# Altium schematic sheet Shutdown_2019_v1.1_BSPD.SchDoc: Shutdown_2019_v1.1
size 453 x 301 mm; Date: 1/4/2019 10:42:16 PM; SheetNumber: 3; GateName_1: G$1; SymbolName_1: FRAME_B_L; LibraryName: frames; DeviceSetName: FRAME_B_L; GateName_2: G$2; SymbolName_2: DOCFIELD
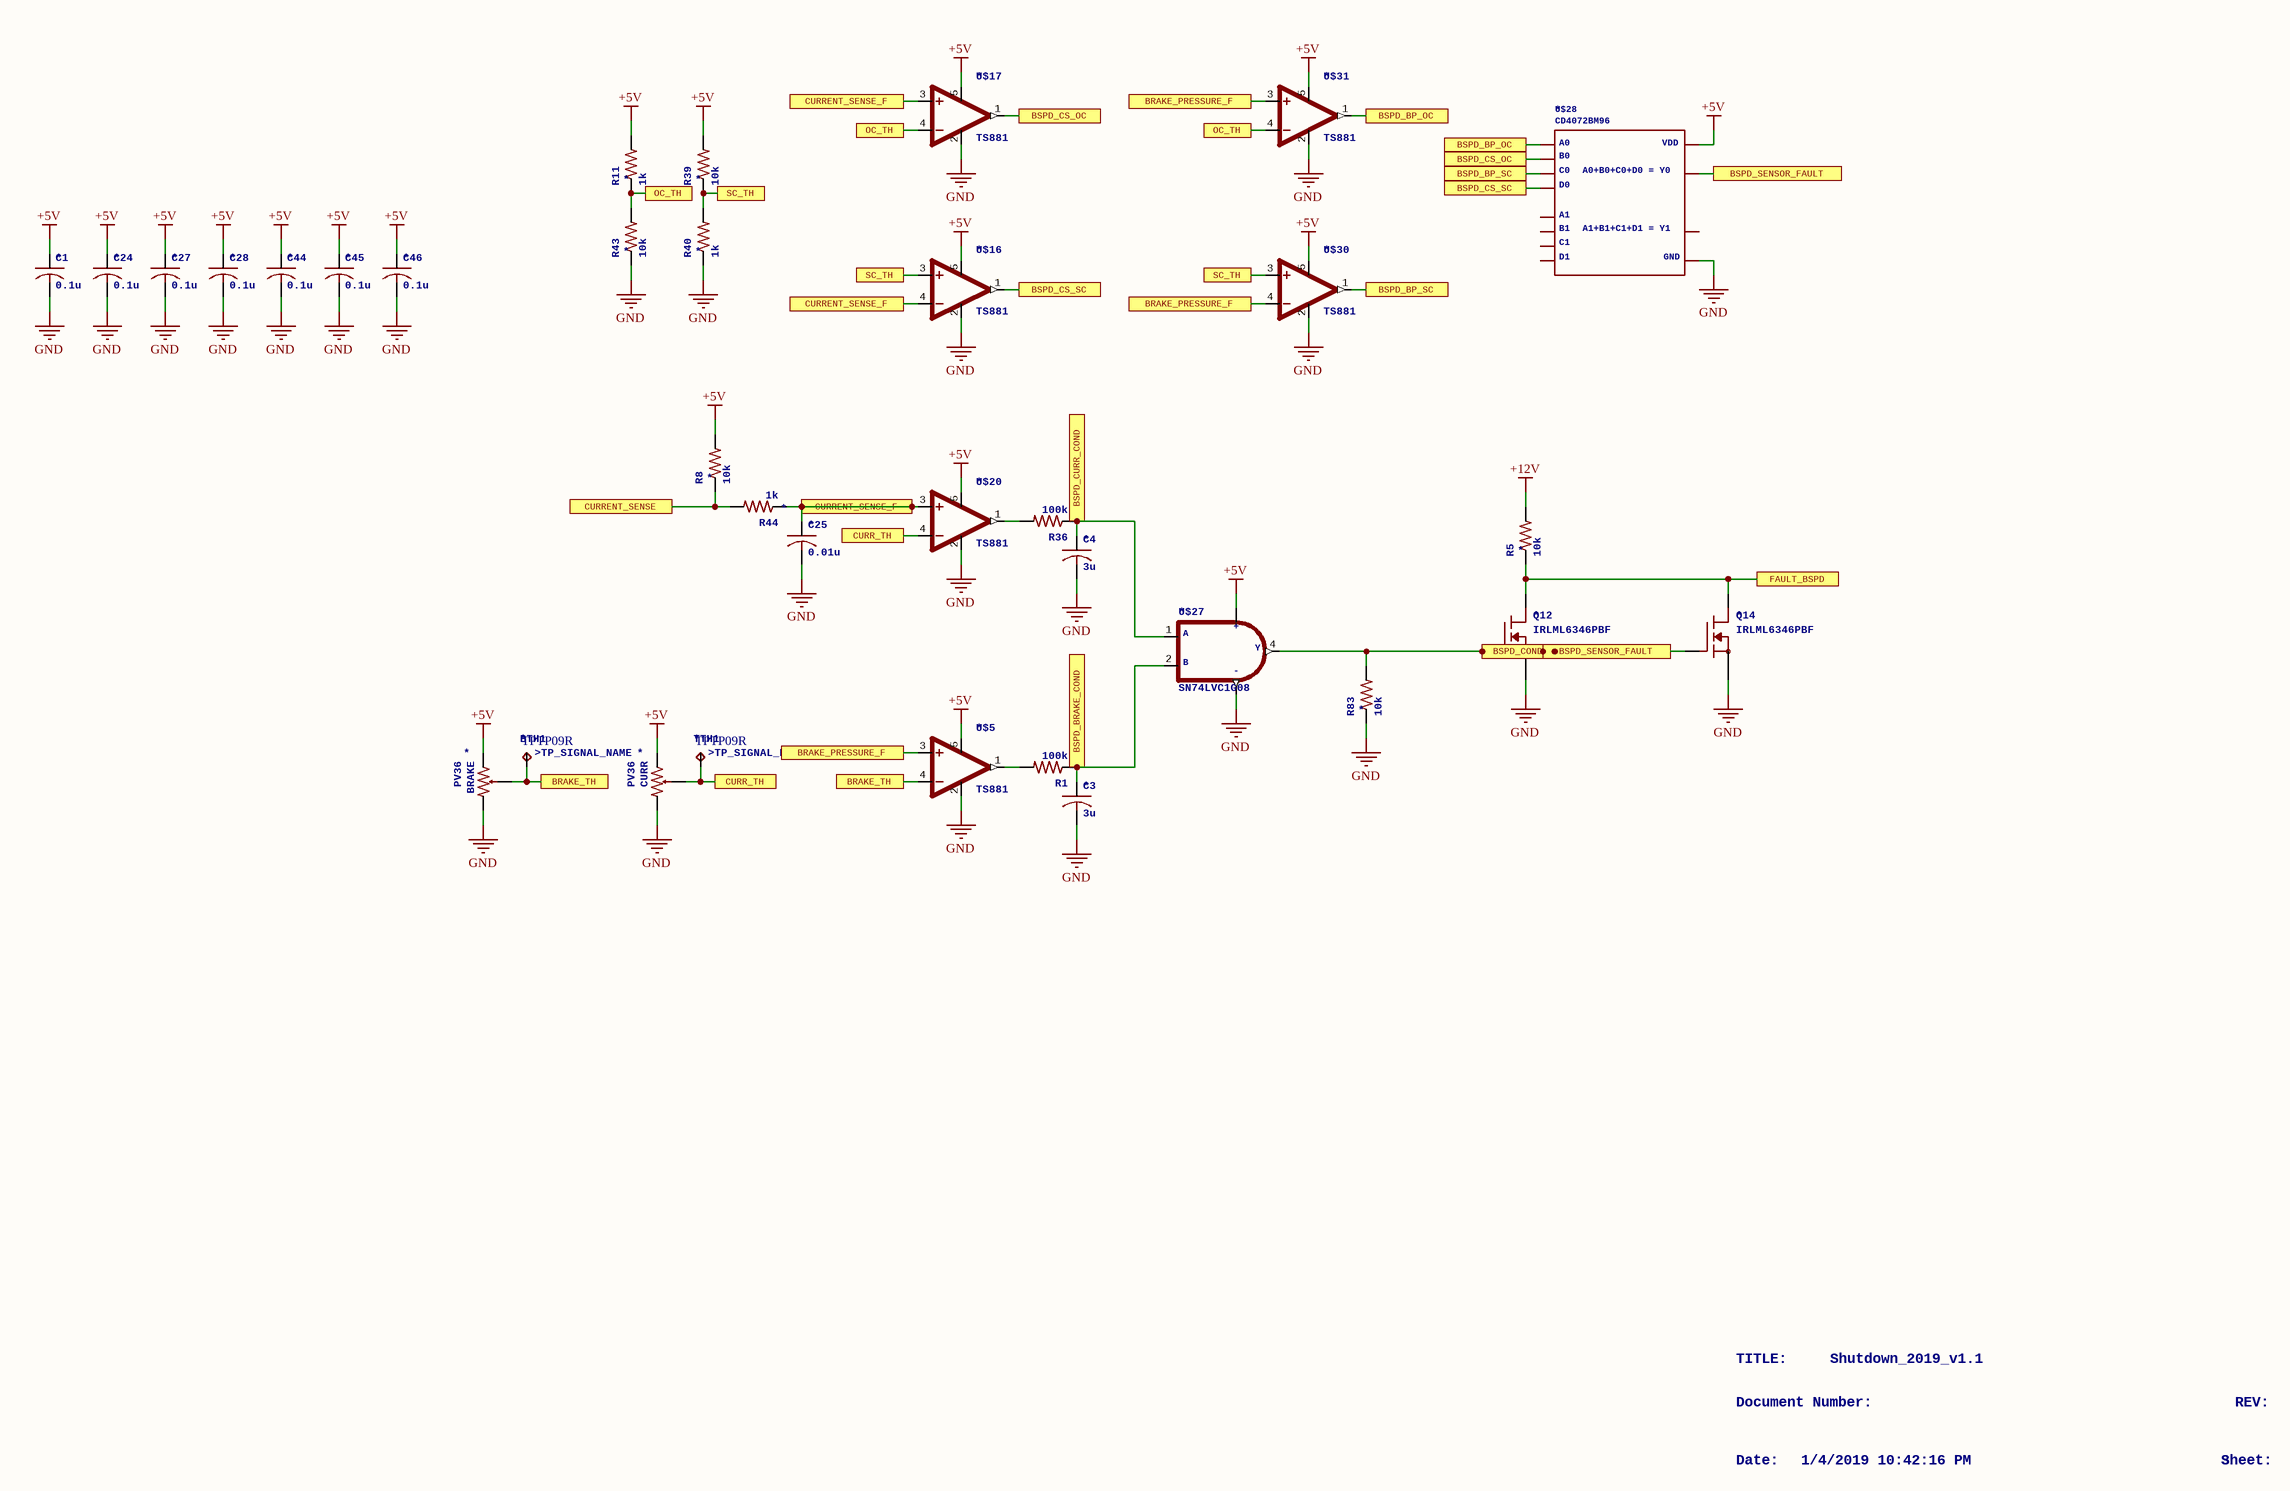
[diagram p0: Shutdown_2019_v1.1_BSPD.SchDoc]

## Parts
BRAKE  PV36  [PV36]
BTH1  TPTP09R  TP_SIGNAL_NAME: >TP_SIGNAL_NAME  [TP09R]
C1  0.1u  [C0603]
C3  3u  [C0603]
C4  3u  [C0603]
C24  0.1u  [C0603]
C25  0.01u  [C0603]
C27  0.1u  [C0603]
C28  0.1u  [C0603]
C44  0.1u  [C0603]
C45  0.1u  [C0603]
C46  0.1u  [C0603]
CURR  PV36  [PV36]
Q12  IRLML6346PBF  [SOT23]
Q14  IRLML6346PBF  [SOT23]
R1  100k  [R0603]
R5  10k  [R0603]
R8  10k  [R0603]
R11  1k  [R0603]
R36  100k  [R0603]
R39  10k  [R0603]
R40  1k  [R0603]
R43  10k  [R0603]
R44  1k  [R0603]
R83  10k  [R0603]
TTH1  TPTP09R  TP_SIGNAL_NAME: >TP_SIGNAL_NAME  [TP09R]
U$5  TS881  [SOT23-5]
U$16  TS881  [SOT23-5]
U$17  TS881  [SOT23-5]
U$20  TS881  [SOT23-5]
U$27  SN74LVC1G08  [SOT23-5]
U$28  CD4072BM96  A0+B0+C0+D0=Y0: A0+B0+C0+D0 = Y0  A1+B1+C1+D1=Y1: A1+B1+C1+D1 = Y1  [SOIC8]
U$30  TS881  [SOT23-5]
U$31  TS881  [SOT23-5]

## Ports
BRAKE_PRESSURE_F, BRAKE_TH, BSPD_BP_OC, BSPD_BP_SC, BSPD_BRAKE_COND, BSPD_COND, BSPD_CS_OC, BSPD_CS_SC, BSPD_CURR_COND, BSPD_SENSOR_FAULT, CURR_TH, CURRENT_SENSE, CURRENT_SENSE_F, FAULT_BSPD, OC_TH, SC_TH

## Nets
+5V: BRAKE.A C1.1 C24.1 C27.1 C28.1 C44.1 C45.1 C46.1 CURR.A R8.2 R11.2 R39.2 U$5.5(VDD) U$16.5(VDD) U$17.5(VDD) U$20.5(VDD) U$27.5(VDD) U$28.P14(VDD) U$30.5(VDD) U$31.5(VDD)
+12V: R5.2
GND: BRAKE.B C1.2 C3.2 C4.2 C24.2 C25.2 C27.2 C28.2 C44.2 C45.2 C46.2 CURR.B Q12.2(S) Q14.2(S) R40.1 R43.1 R83.1 U$5.2(GND) U$16.2(GND) U$17.2(GND) U$20.2(GND) U$27.3(GND) U$28.P7(GND) U$30.2(GND) U$31.2(GND)
BRAKE_PRESSURE_F: U$5.3(+IN) U$30.4(-IN) U$31.3(+IN) ; port BRAKE_PRESSURE_F
BRAKE_TH: BRAKE.W BTH1.TP U$5.4(-IN) ; port BRAKE_TH
BSPD_BP_OC: U$28.P2(A0) U$31.1(OUT) ; port BSPD_BP_OC
BSPD_BP_SC: U$28.P4(C0) U$30.1(OUT) ; port BSPD_BP_SC
BSPD_BRAKE_COND: C3.1 R1.1 U$27.2(B) ; port BSPD_BRAKE_COND
BSPD_COND: Q12.1(G) R83.2 U$27.4(Y) ; port BSPD_COND
BSPD_CS_OC: U$17.1(OUT) U$28.P3(B0) ; port BSPD_CS_OC
BSPD_CS_SC: U$16.1(OUT) U$28.P5(D0) ; port BSPD_CS_SC
BSPD_CURR_COND: C4.1 R36.1 U$27.1(A) ; port BSPD_CURR_COND
BSPD_SENSOR_FAULT: Q14.1(G) U$28.P1(Y0) ; port BSPD_SENSOR_FAULT
CURR_TH: CURR.W TTH1.TP U$20.4(-IN) ; port CURR_TH
CURRENT_SENSE: R8.1 R44.2 ; port CURRENT_SENSE
CURRENT_SENSE_F: C25.1 R44.1 U$16.4(-IN) U$17.3(+IN) U$20.3(+IN) ; port CURRENT_SENSE_F
FAULT_BSPD: Q12.3(D) Q14.3(D) R5.1 ; port FAULT_BSPD
OC_TH: R11.1 R43.2 U$17.4(-IN) U$31.4(-IN) ; port OC_TH
SC_TH: R39.1 R40.2 U$16.3(+IN) U$30.3(+IN) ; port SC_TH
NetR1_2: R1.2 U$5.1(OUT)
NetR36_2: R36.2 U$20.1(OUT)

Not connected (* = marked no-connect by the designer): U$28 P9(A1) P10(B1) P11(C1) P12(D1) P13(Y1)

## Notes on the sheet
- TITLE:
- Document Number:
- Shutdown_2019_v1.1
- REV:
- Date:
- 1/4/2019 10:42:16 PM
- Sheet:
- 3
- 1
- 2
- 4
- 5
- 6
- 7
- 8
- 9
- A
- B
- C
- D
- E
- F

## Library data of the parts
BRAKE CURR = PV36: BOURNS PV36  Bourns PV36 Potentiometer Datasheet; GateName_1: G$1; SymbolName_1: POTENTIOMETER; LibraryName: BOURNS; DeviceSetName: PV36; NAME: *
BTH1 TTH1 = TPTP09R: Test pad; GateName_1: G$1; SymbolName_1: TP; DeviceName: TP09R; LibraryName: testpad; DeviceSetName: TP; NAME: *
C1 C3 C4 C24 C25 C27 C28 C44-C46 = C-USC0603: CAPACITOR, American symbol; GateName_1: G$1; SymbolName_1: C-US-1; DeviceSetName: C-US; DeviceName: C0603; LibraryName: resistor; NAME: *
Q12 Q14 = IRLML6346PBF: IRLML6346TRPBF Vgs(th) = 1.1V, Rds(on) = 63 mOhm, Vds(max) = 30V; GateName_1: G$1; SymbolName_1: N-MOSFET-GDS; LibraryName: TRANS; DeviceSetName: IRLML6346PBF; NAME: *
R1 R5 R8 R11 R36 R39 R40 R43 R44 R83 = R-US_R0603: RESISTOR, American symbol; GateName_1: G$1; SymbolName_1: R-US; DeviceSetName: R-US_; DeviceName: R0603; LibraryName: resistor; NAME: *
U$5 U$16 U$17 U$20 U$30 U$31 = TS881: STM TS881Single rail to rail comparator with push pull output.Datasheet; GateName_1: G$1; SymbolName_1: OP-AMP; LibraryName: STM; DeviceSetName: TS881; NAME: *
U$27 = SN74LVC1G08: Texas Insturments SN74LVC1G08   Single 2-Input Positive-AND Gate  Datasheet; GateName_1: G$1; SymbolName_1: AND; LibraryName: TEXAS_INSTRUMENTS; DeviceSetName: SN74LVC1G08; NAME: *; A: A; B: B; Y: Y; +: +; -: -
U$28 = CD4072B: TI CD4072BM96 Quad Input 2 Channel OR Gate SOIC-14 Datasheet; GateName_1: G$1; SymbolName_1: QUAD_INPUT_OR; LibraryName: TEXAS_INSTRUMENTS; DeviceSetName: CD4072B; NAME: *; A0: A0; B0: B0; C0: C0; D0: D0; A1: A1; B1: B1; C1: C1; D1: D1; VDD: VDD; GND: GND